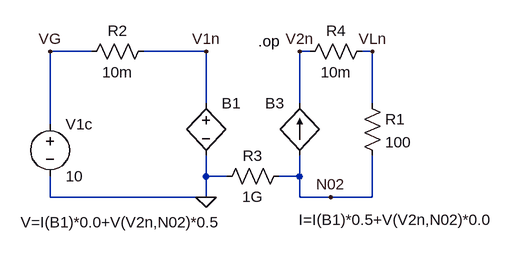
[diagram p0: schematic test2.asc]
test2.asc, the LTspice schematic file:
Version 4
SHEET 1 880 680
WIRE -32 48 -96 48
WIRE 144 48 48 48
WIRE 304 48 288 48
WIRE 400 48 384 48
WIRE 144 128 144 48
WIRE 288 128 288 48
WIRE 400 128 400 48
WIRE -96 160 -96 48
WIRE 144 240 144 208
WIRE 176 240 144 240
WIRE 288 240 288 208
WIRE 288 240 256 240
WIRE -96 272 -96 240
WIRE 144 272 144 240
WIRE 144 272 -96 272
WIRE 288 272 288 240
WIRE 336 272 288 272
WIRE 400 272 400 208
WIRE 400 272 336 272
FLAG 144 272 0
FLAG 144 48 V1n
FLAG 288 48 V2n
FLAG -96 48 VG
FLAG 400 48 VLn
FLAG 336 272 N02
SYMBOL bv 144 112 R0
WINDOW 3 -285 199 Left 2
SYMATTR InstName B1
SYMATTR Value V=I(B1)*0.0+V(V2n,N02)*0.5
SYMBOL res 384 112 R0
SYMATTR InstName R1
SYMATTR Value 100
SYMBOL voltage -96 144 R0
WINDOW 123 0 0 Left 0
WINDOW 39 0 0 Left 0
SYMATTR InstName V1c
SYMATTR Value 10
SYMBOL res 64 32 R90
WINDOW 0 0 56 VBottom 2
WINDOW 3 32 56 VTop 2
SYMATTR InstName R2
SYMATTR Value 10m
SYMBOL res 272 224 R90
WINDOW 0 0 56 VBottom 2
WINDOW 3 32 56 VTop 2
SYMATTR InstName R3
SYMATTR Value 1G
SYMBOL res 400 32 R90
WINDOW 0 0 56 VBottom 2
WINDOW 3 32 56 VTop 2
SYMATTR InstName R4
SYMATTR Value 10m
SYMBOL bi 288 208 R180
WINDOW 0 24 80 Left 2
WINDOW 3 -298 -99 Left 2
SYMATTR InstName B3
SYMATTR Value I=I(B1)*0.5+V(V2n,N02)*0.0
TEXT 224 32 Left 2 !.op

The netlist it stands for:
* test2.asc
B1 V1n 0 V=I(B1)*0.0+V(V2n,N02)*0.5
R1 VLn N02 100
V1c VG 0 10
R2 V1n VG 10m
R3 N02 0 1G
R4 VLn V2n 10m
B3 N02 V2n I=I(B1)*0.5+V(V2n,N02)*0.0
.op
.backanno
.end